# EAGLE design CRLH-v1.2 (EAGLE 9.6.2)
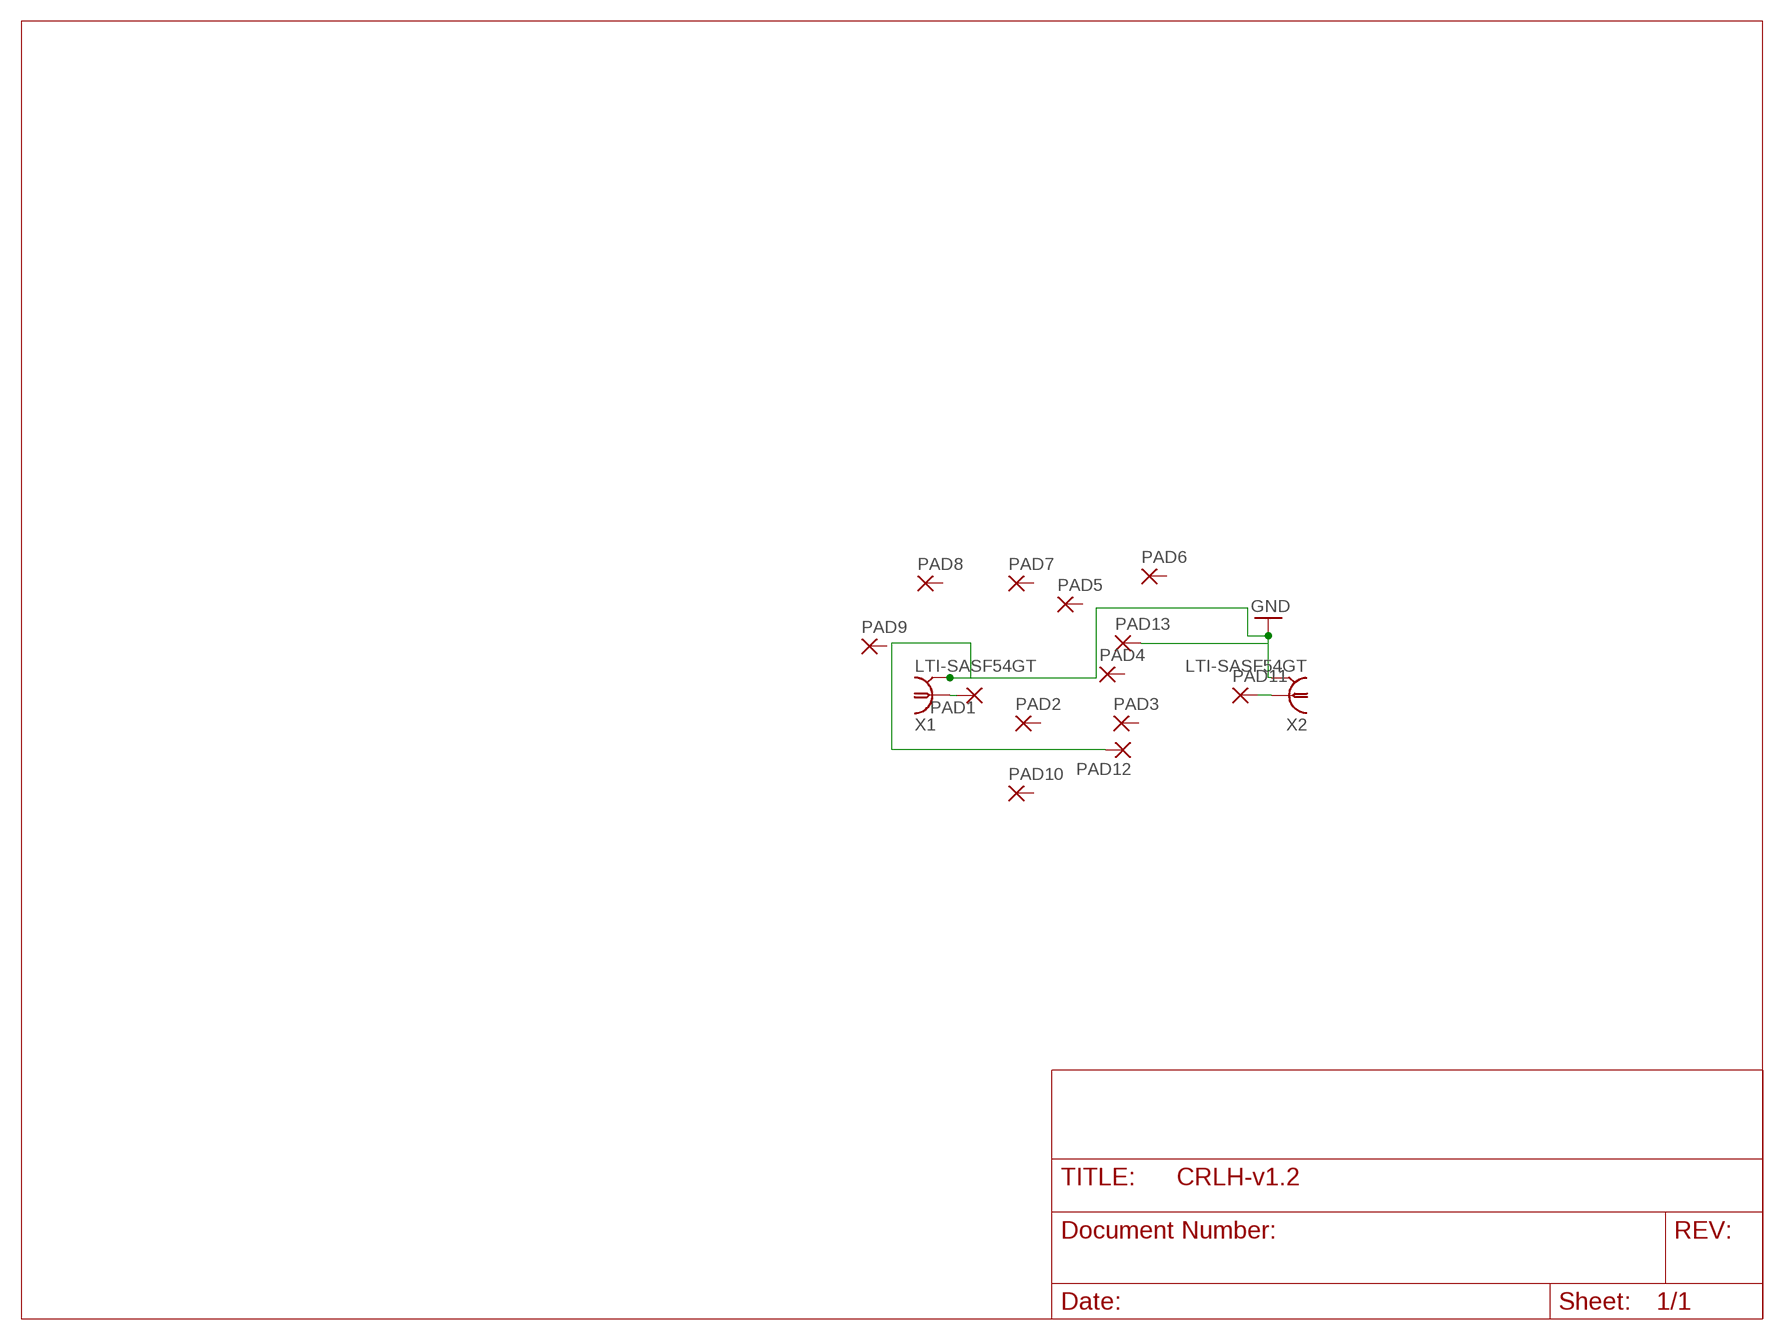
[diagram p0: schematic, sheet 1]

## Parts
PAD1  SMD5  [SMD2,54-5,08]
PAD2  SMD5  [SMD2,54-5,08]
PAD3  SMD5  [SMD2,54-5,08]
PAD4  SMD5  [SMD2,54-5,08]
PAD5  SMD5  [SMD2,54-5,08]
PAD6  SMD5  [SMD2,54-5,08]
PAD7  SMD5  [SMD2,54-5,08]
PAD8  SMD5  [SMD2,54-5,08]
PAD9  SMD5  [SMD2,54-5,08]
PAD10  SMD5  [SMD2,54-5,08]
PAD11  SMD5  [SMD2,54-5,08]
PAD12  SMD5  [SMD2,54-5,08]
PAD13  SMD5  [SMD2,54-5,08]
X1  LTI-SASF54GT  [LTI-SASF54GT]
X2  LTI-SASF54GT  [LTI-SASF54GT]

## Nets
GND: PAD12.1(P) PAD13.1(P) X1.2 X1.3 X1.4 X1.5 X2.2 X2.3 X2.4 X2.5
N$1: PAD1.1(P) X1.1
PAD11: PAD11.1(P) X2.1
Unconnected: PAD2.1(P) PAD3.1(P) PAD4.1(P) PAD5.1(P) PAD6.1(P) PAD7.1(P) PAD8.1(P) PAD9.1(P) PAD10.1(P)

## Library data of the parts
PAD1-PAD10 = pad11x3mm:SMD5: SMD PAD
PAD11 = pad1x3mm:SMD5: SMD PAD
PAD12 PAD13 = pad97x2mm:SMD5: SMD PAD
X1 X2 = con-coax:LTI-SASF54GT: SMA vertical PCB thrue hole jack Source: Lighthorse Technologies, inc. SASF54GT.pdf; OC_FARNELL: unknown; OC_NEWARK: unknown

## Board
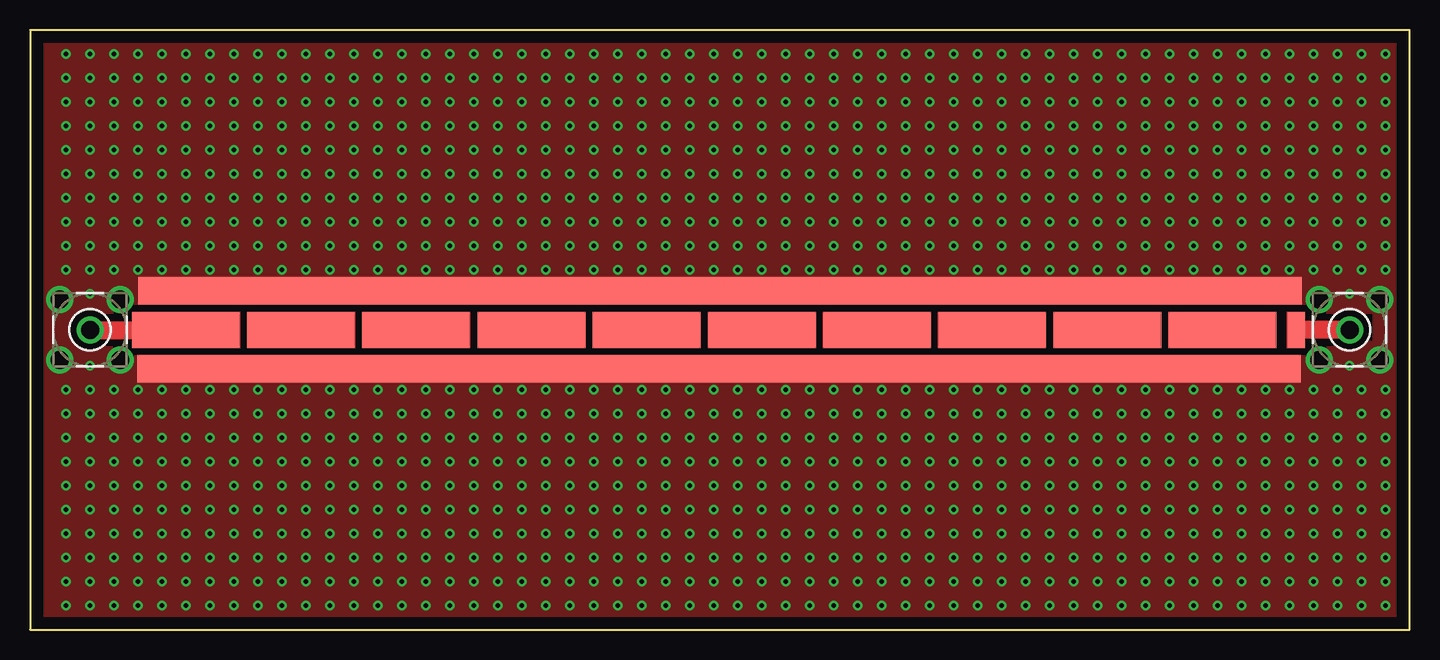
[diagram p1: board, top side]
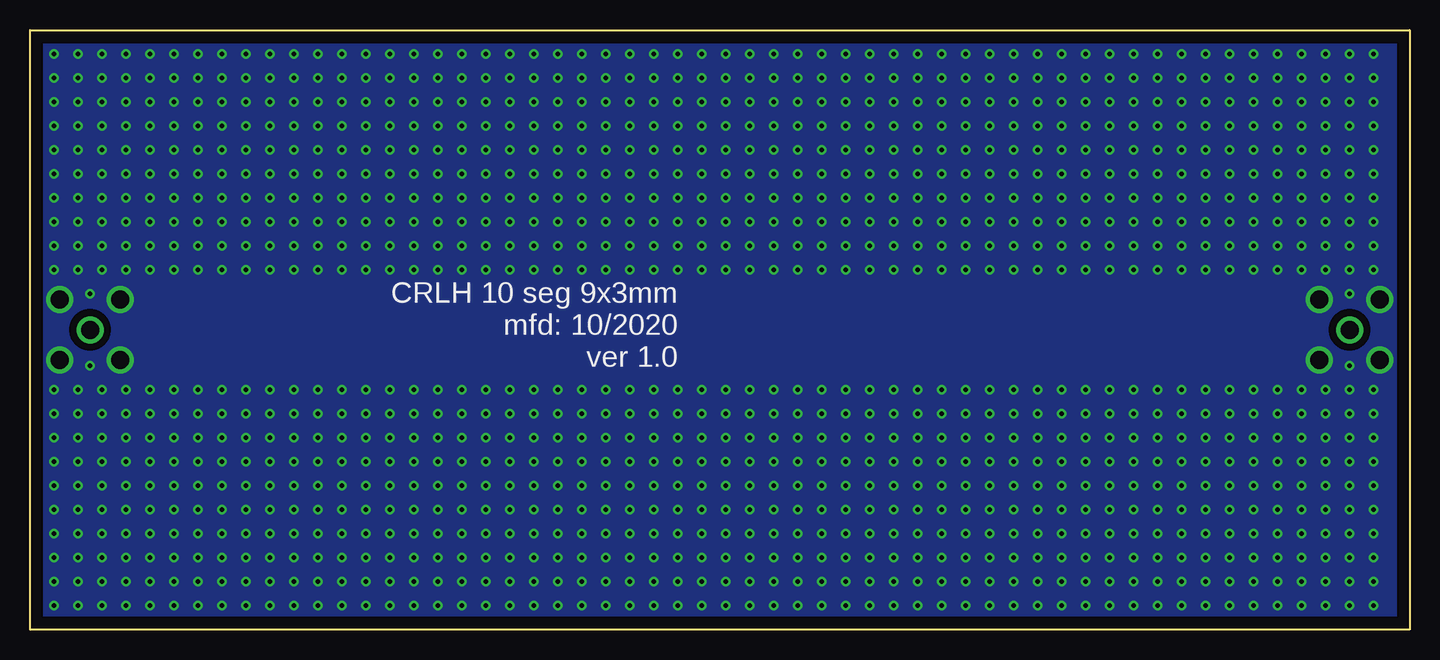
[diagram p2: board, bottom side, seen from below]

Size 115 x 50 mm. Coordinates in mm from the lower left corner, seen from the top.
Outline: 0,0 100,0
Outline: 0,0 115,0 115,50 0,50 0,0
Copper layers (1*16): Top 0.035mm / dielectric 1.5mm / Bottom 0.035mm
Design rules "default *": minimum track width 6mil, minimum drill 0.35mm, track to track 0.6mm, track to pad 0.6mm, pad to pad 0.6mm, via to via 0.6mm, smd to smd 0.6mm, copper to edge 40mil, drill to drill 6mil, minimum pad ring 10mil, minimum via ring 8mil, stop-mask expansion 4mil, vias tented up to drill 0mil, thermal gap 0mil

### Footprints (pad centres in the part's own frame; a part is rotated, then mirrored left to right if it is on the bottom)
SMD2,54-5,08 = smd 9 x 3: 1 -1,-1
SMD2,54-5,08' = smd 1.5 x 3: 1 -1,-1
SMD2,54-5,08'' = smd 97 x 2.3: 1 -1,-1
LTI-SASF54GT = drill 1.5 pad 2.2: 1 0,0; 2 -2.54,2.54; 3 2.54,2.54; 4 2.54,-2.54; 5 -2.54,-2.54

### Placement (x,y rotation side)
PAD1  14,26 0 top
PAD2  23.6,26 0 top
PAD3  33.2,26 0 top
PAD4  42.8,26 0 top
PAD5  52.4,26 0 top
PAD6  62,26 0 top
PAD7  71.6,26 0 top
PAD8  81.2,26 0 top
PAD9  90.8,26 0 top
PAD10  100.4,26 0 top
PAD11  [SMD2,54-5,08']  106.5,26 0 top
PAD12  [SMD2,54-5,08'']  58.45,22.75 0 top
PAD13  [SMD2,54-5,08'']  58.5,29.25 0 top
X1  5,25 90 top
X2  110,25 0 top

### Tracks (layer width: path | path; a pad name or v marks a point on that pad's centre or on a via)
GND  (via drill 0.35)
  Top 0.5: PAD13.1 16,28.2
  other vias: 3,48 5,48 7,48 9,48 11,48 13,48 15,48 17,48 19,48 21,48 23,48 25,48 27,48 29,48 31,48 29,46 31,46 33,48 33,46 35,48 35,46 37,46 37,48 39,48 39,46 41,48 41,46 45,48 47,48 49,48 51,48 53,48 55,48 57,48 59,48 61,48 63,48 65,48 67,48 69,48 71,48 73,48 75,48 15,46 13,46 11,46 9,46 7,46 5,46 3,46 3,44 5,44 7,44 9,44 11,44 13,44 15,44 17,44 19,44 21,44 23,44 25,44 27,44 29,44 31,44 33,44 35,44 37,44 39,44 41,44 43,44 45,44 47,44 49,44 51,44 53,44 55,44 57,44 59,44 61,44 63,44 65,44 67,44 69,44 71,44 73,44 75,44 77,44 79,44 81,44 83,44 85,44 87,44 17,46 19,46 21,46 23,46 25,46 27,46 43,48 43,46 45,46 47,46 49,46 51,46 53,46 55,46 57,46 59,46 61,46 63,46 65,46 67,46 69,46 71,46 73,46 75,46 77,48 77,46 79,46 79,48 81,48 81,46 83,48 83,46 85,48 85,46 87,48 87,46 89,48 89,46 91,48 91,46 93,48 93,46 95,48 95,46 97,46 97,48 99,48 99,46 101,48 101,46 103,46 103,48 105,48 105,46 107,48 107,46 109,46 109,48 111,48 111,46 113,48 113,46 113,44 113,42 111,42 111,44 109,44 109,42 107,44 107,42 105,44 105,42 103,44 103,42 101,44 101,42 99,44 99,42 97,42 97,44 95,44 95,42 93,42 93,44 91,44 91,42 89,42 89,44 87,42 85,42 83,42 81,42 79,42 77,42 75,42 73,42 71,42 69,42 67,42 65,42 63,42 61,42 59,42 57,42 55,42 53,42 51,42 49,42 47,42 45,42 43,42 41,42 39,42 37,42 35,42 33,42 31,42 29,42 27,42 25,42 23,42 21,42 19,42 17,42 15,42 13,42 11,42 9,42 7,42 5,42 3,42 3,40 5,40 7,40 9,40 11,40 13,40 15,40 17,40 19,40 21,40 23,40 25,40 27,40 29,40 31,40 33,40 35,40 37,40 3,38 3,36 3,34 3,32 3,30 5,30 5,28 5,32 5,34 5,36 5,38 7,38 7,36 7,34 7,32 7,30 9,30 9,32 9,34 9,36 9,38 11,38 11,36 11,34 11,32 11,30 13,30 13,32 13,34 13,36 13,38 15,38 15,36 15,34 15,32 15,30 17,30 17,32 17,34 17,36 17,38 19,38 19,36 19,34 19,32 19,30 21,30 21,32 21,34 21,36 21,38 23,38 23,36 23,34 23,32 23,30 25,30 25,32 25,34 25,38 25,36 27,38 27,36 27,34 27,32 27,30 29,30 29,32 29,34 29,36 29,38 31,38 31,36 31,34 31,32 31,30 33,30 33,32 33,34 33,36 33,38 35,38 35,36 35,34 35,32 35,30 37,30 37,32 37,34 37,36 37,38 39,38 39,36 39,34 39,32 39,30 41,30 41,32 41,34 41,36 41,38 39,40 43,40 43,38 43,36 43,34 43,32 43,30 45,30 45,32 45,34 45,36 45,38 45,40 47,40 47,38 47,36 47,34 47,32 47,30 49,30 49,32 49,34 49,36 49,38 49,40 51,40 51,38 51,36 51,34 51,32 51,30 53,30 53,32 53,34 53,36 53,38 53,40 55,40 55,38 55,36 55,34 55,32 55,30 57,30 57,32 57,34 57,36 57,38 57,40 59,40 59,38 59,36 59,34 59,32 59,30 61,30 61,32 61,34 61,36 61,38 61,40 63,40 63,38 63,36 63,34 63,32 63,30 65,40 65,38 65,36 65,34 65,32 65,30 67,30 67,32 67,34 67,36 67,38 67,40 69,40 69,38 69,36 69,34 69,32 69,30 71,30 71,32 71,34 71,36 71,38 71,40 73,40 73,38 73,36 73,34 73,32 73,30 75,40 75,38 75,36 75,34 75,32 75,30 77,30 77,32 77,34 77,36 77,38 77,40 79,40 79,38 79,36 79,34 79,32 79,30 81,30 81,32 81,34 81,36 81,38 81,40 83,40 83,38 83,36 83,34 83,32 83,30 85,30 85,32 85,34 85,36 85,38 85,40 87,40 87,38 87,36 87,34 87,32 87,30 89,30 89,32 89,34 89,36 89,38 89,40 91,40 91,38 91,36 91,34 91,32 91,30 93,40 93,38 93,36 93,34 93,32 93,30 95,30 95,32 95,34 95,36 95,38 95,40 97,40 97,38 97,36 97,34 97,32 97,30 99,30 99,32 99,34 99,36 99,38 99,40 101,40 101,38 101,36 101,34 101,32 101,30 103,30 103,32 103,34 103,36 103,38 103,40 105,40 105,38 105,36 105,34 105,32 105,30 107,30 107,32 107,34 107,36 107,38 107,40 109,40 109,38 109,36 109,34 109,32 109,30 110,28 111,30 111,32 111,34 111,36 111,38 111,40 113,40 113,38 113,36 113,34 113,32 113,30 41,40 5,22 3,20 3,18 3,16 3,14 3,12 3,10 3,8 3,6 3,4 3,2 5,2 5,4 5,6 5,8 5,10 5,12 5,14 5,16 5,18 5,20 7,20 7,18 7,16 7,14 7,12 7,10 7,8 7,6 7,4 7,2 9,2 9,4 9,6 9,8 9,10 9,12 9,14 9,16 9,18 9,20 11,20 11,18 11,16 11,14 11,12 11,10 11,8 11,6 11,4 11,2 13,2 13,4 13,6 13,8 13,10 13,12 13,14 13,16 13,18 13,20 15,20 15,18 15,16 15,14 15,12 15,10 15,8 15,6 15,4 15,2 17,2 17,4 17,6 17,8 17,10 17,12 17,14 17,16 17,18 17,20 19,20 19,18 19,16 19,14 19,12 19,10 19,8 19,6 19,4 19,2 21,2 21,4 21,6 21,8 21,10 21,12 21,14 21,16 21,18 21,20 23,20 23,18 23,16 23,14 23,12 23,10 23,8 23,6 23,4 23,2 25,2 25,4 25,6 25,8 25,10 25,12 25,14 25,16 25,18 25,20 27,20 27,18 27,16 27,14 27,12 27,10 27,8 27,6 27,4 27,2 29,2 29,4 29,6 29,8 29,10 29,12 29,14 29,16 29,18 29,20 31,20 31,18 31,16 31,14 31,12 31,10 31,8 31,6 31,4 31,2 33,2 33,4 33,6 33,8 33,10 33,12 33,14 33,16 33,18 33,20 35,20 35,18 35,16 35,14 35,12 35,10 35,8 35,6 35,4 35,2 37,2 37,4 37,6 37,8 37,10 37,12 37,14 37,16 37,18 37,20 39,20 39,18 39,16 39,14 39,12 39,10 39,8 39,6 39,4 39,2 41,2 41,4 41,6 41,8 41,10 41,12 41,14 41,16 41,18 41,20 43,20 43,18 43,16 43,14 43,12 43,10 43,8 43,6 43,4 43,2 45,2 45,4 45,6 45,8 45,10 45,12 45,14 45,16 45,18 45,20 47,20 47,18 47,16 47,14 47,12 47,10 47,8 47,6 47,4 47,2 49,2 49,4 49,6 49,8 49,10 49,12 49,14 49,16 49,18 49,20 51,20 51,18 51,16 51,14 51,12 51,10 51,8 51,6 51,4 51,2 53,2 53,4 53,6 53,8 53,10 53,12 53,14 53,16 53,18 53,20 55,20 55,18 55,16 55,14 55,12 55,10 55,8 55,6 55,4 55,2 57,2 57,4 57,6 57,8 57,10 57,12 57,14 57,16 57,18 57,20 59,20 59,18 59,16 59,14 59,12 59,10 59,8 59,6 59,4 59,2 61,2 61,4 61,6 61,8 61,10 61,12 61,14 61,16 61,18 61,20 63,20 63,18 63,16 63,14 63,12 63,10 63,8 63,6 63,4 63,2 65,2 65,4 65,6 65,8 65,10 65,12 65,14 65,16 65,18 65,20 67,20 67,18 67,16 67,14 67,12 67,10 67,8 67,6 67,4 67,2 69,2 69,4 69,6 69,8 69,10 69,12 69,14 69,16 69,18 69,20 71,20 71,18 71,16 71,14 71,12 71,10 71,8 71,6 71,4 71,2 73,2 73,4 73,6 73,8 73,10 73,12 73,14 73,16 73,18 73,20 75,20 75,18 75,16 75,14 75,12 75,10 75,8 75,6 75,4 75,2 77,2 77,4 77,6 77,8 77,10 77,12 77,14 77,16 77,18 77,20 79,20 79,18 79,16 79,14 79,12 79,10 79,8 79,6 79,4 79,2 81,2 81,4 81,6 81,8 81,10 81,12 81,14 81,16 81,18 81,20 83,20 83,18 83,16 83,14 83,12 83,10 83,8 83,6 83,4 83,2 85,2 85,4 85,6 85,8 85,10 85,12 85,14 85,16 85,18 85,20 87,20 87,18 87,16 87,14 87,12 87,10 87,8 87,6 87,4 87,2 89,2 89,4 89,6 89,8 89,10 89,12 89,14 89,16 89,18 89,20 91,20 91,18 91,16 91,14 91,12 91,10 91,8 91,6 91,4 91,2 93,2 93,4 93,6 93,8 93,10 93,12 93,14 93,16 93,18 93,20 95,20 95,18 95,16 95,14 95,12 95,10 95,8 95,6 95,4 95,2 97,2 97,4 97,6 97,8 97,10 97,12 97,14 97,16 97,18 97,20 99,20 99,18 99,16 99,14 99,12 99,10 99,8 99,6 99,4 99,2 101,2 101,4 101,6 101,8 101,10 101,12 101,14 101,16 101,18 101,20 103,20 103,18 103,16 103,14 103,12 103,10 103,8 103,6 103,4 103,2 105,2 105,4 105,6 105,8 105,10 105,12 105,14 105,16 105,18 105,20 107,20 107,18 107,16 107,14 107,12 107,10 107,8 107,6 107,4 107,2 109,2 109,4 109,6 109,8 109,10 109,12 109,14 109,16 109,18 109,20 111,20 111,18 111,16 111,14 111,12 111,10 111,8 111,6 111,4 111,2 113,2 113,4 113,6 113,8 113,10 113,12 113,14 113,16 113,18 113,20 110,22
  pour Top (isolate 0.406): 1,24 115,24 115,0 1,0
  pour Bottom (isolate 0.254): 115,50 0,50 0,0 115,0
  pour Bottom: 1,21 115,21 115,0 1,0
  pour Top (isolate 0.1): 0,50 0,26 10,26 10,26.48 115,26.48 115,50
  pour Top (isolate 0.406): 4,26 4,19 0,19 0,26
  pour Top (isolate 0.406): 112,27 112,21 115,21 115,27
N$1
  Top 1.5: X1.1 PAD1.1
PAD11
  Top 1.5: X2.1 PAD11.1

### Text on the board
bNames: CRLH 10 seg 9x3mm / mfd: 10/2020 / ver 1.0